# Altium schematic sheet microcontroller.SchDoc
size A4; SheetNumber: 5; SheetTotal: 6
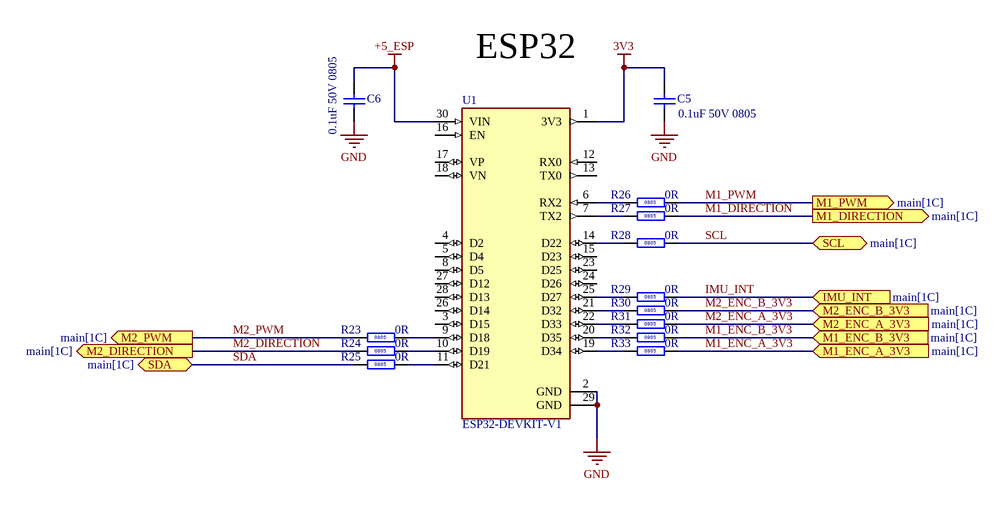
[diagram p0: microcontroller.SchDoc]

## Parts
C5  0.1uF 50V 0805  [CAPC2012X14N]
C6  0.1uF 50V 0805  [CAPC2012X14N]
R23  0R  [Copy of RESC2013X60X35NL10T20]
R24  0R  [Copy of RESC2013X60X35NL10T20]
R25  0R  [Copy of RESC2013X60X35NL10T20]
R26  0R  [Copy of RESC2013X60X35NL10T20]
R27  0R  [Copy of RESC2013X60X35NL10T20]
R28  0R  [Copy of RESC2013X60X35NL10T20]
R29  0R  [Copy of RESC2013X60X35NL10T20]
R30  0R  [Copy of RESC2013X60X35NL10T20]
R31  0R  [Copy of RESC2013X60X35NL10T20]
R32  0R  [Copy of RESC2013X60X35NL10T20]
R33  0R  [Copy of RESC2013X60X35NL10T20]
U1  ESP32-DEVKIT-V1  [MODULE_ESP32_DEVKIT_V1]

## Ports
IMU_INT (in, see main[1C]), M1_DIRECTION (out, see main[1C]), M1_ENC_A_3V3 (in, see main[1C]), M1_ENC_B_3V3 (in, see main[1C]), M1_PWM (out, see main[1C]), M2_DIRECTION (out, see main[1C]), M2_ENC_A_3V3 (in, see main[1C]), M2_ENC_B_3V3 (in, see main[1C]), M2_PWM (out, see main[1C]), SCL (bidir, see main[1C]), SDA (bidir, see main[1C])

## Nets
3V3: C5.2 U1.1(3V3)
+5_ESP: C6.2 U1.30(VIN)
GND: C5.1 C6.1 U1.2(GND) U1.29(GND)
IMU_INT: R29.2 ; port IMU_INT
M1_DIRECTION: R27.2 ; port M1_DIRECTION
M1_ENC_A_3V3: R33.2 ; port M1_ENC_A_3V3
M1_ENC_B_3V3: R32.2 ; port M1_ENC_B_3V3
M1_PWM: R26.2 ; port M1_PWM
M2_DIRECTION: R24.1 ; port M2_DIRECTION
M2_ENC_A_3V3: R31.2 ; port M2_ENC_A_3V3
M2_ENC_B_3V3: R30.2 ; port M2_ENC_B_3V3
M2_PWM: R23.1 ; port M2_PWM
SCL: R28.2 ; port SCL
SDA: R25.1 ; port SDA
NetR23_2: R23.2 U1.9(D18)
NetR24_2: R24.2 U1.10(D19)
NetR25_2: R25.2 U1.11(D21)
NetR26_1: R26.1 U1.6(RX2)
NetR27_1: R27.1 U1.7(TX2)
NetR28_1: R28.1 U1.14(D22)
NetR29_1: R29.1 U1.25(D27)
NetR30_1: R30.1 U1.21(D32)
NetR31_1: R31.1 U1.22(D33)
NetR32_1: R32.1 U1.20(D35)
NetR33_1: R33.1 U1.19(D34)

Not connected (* = marked no-connect by the designer): U1 3(D15) 4(D2) 5(D4) 8(D5) 12(RX0) 13(TX0) 15(D23) 16(EN) 17(VP) 18(VN) 23(D25) 24(D26) 26(D14) 27(D12) 28(D13)

## Notes on the sheet
- ESP32

## Library data of the parts
C5 C6 = CMP-40-005-00117-1: Cap, SMD, 0.1uF, 50V, 10%, 0805, X7R; Manufacturer: Samsung; ManufacturerPartNumber: CL21B104KBCWPNC; CapacitorType: Ceramic; Value: 100nF; ComponentLinkDescription: Datasheet; Package: 0805; MountingType: SMD; VoltageRating: 50V; Tolerance: 10%; ComponentLinkURL: https://octopart.com/part/samsung-electro-mechanics/CL21B104KBCWPNC; DielectricType: Ceramic
R23-R33 = CMP-40-025-00156-5: Res, SMD, 0R, 0.125W, 1%, 0805; Manufacturer: Yageo; ManufacturerPartNumber: RC0805JR-070RL; ComponentLinkDescription: Datasheet; Package Height: 0.5mm; PowerRating: 125mW; Package Length: 2mm; Value: 0; Rated Temperature: 70°C; Package Width: 1.25mm; Termination: Wraparound; Mounting Technology: Surface Mount; Resistor Type: FIXED RESISTOR; MountingType: SMD; Max Operating Temperature: 155°C; Construction: Chip; RoHS Compliant: Yes; Power: 125mW; Tolerance: 1%; Packaging: Tape and Reel; Pins: 2; Min Operating Temperature: -55°C; Package: 0805; Terminal Finish: Nickel; Package Style: SMTMeter; Case/Package: 0805; Package Shape: Rectangular; ComponentLinkURL: https://datasheet.ciiva.com/pdfs/VipMasterIC/IC/YAGO/YAGO-S-A0008145938/YAGO-S-A0008145938-1.pdf?src-supplier=IHS+Markit; Minimum Operating Temperature: -55°C; Technology: METAL GLAZE/THICK FILM; JESD-609 Code: e3; Maximum Operating Temperature: 155°C; Reach SVHC Compliant: Yes
U1 = ESP32-DEVKIT-V1: Dual core, Wi-Fi: 2.4 GHz up to 150 Mbits/s,BLE (Bluetooth Low Energy) and legacy Bluetooth, 32 bits, Up to 240 MHz; MF: Do it; SnapEDA_Link: https://www.snapeda.com/parts/ESP32-DEVKIT-V1/Do+it/view-part/?ref=snap; Package: None; Value: *; MP: ESP32-DEVKIT-V1; Check_prices: https://www.snapeda.com/parts/ESP32-DEVKIT-V1/Do+it/view-part/?ref=eda